# EasyEDA schematic L6205PD-Dual-Breakout-Board-B.00.02.json
TITLE: L6205PD-Breakout-Board; REV: B.00.02; Date: 2024-02-06; Sheet: 1/1; Drawn By: helmut-f; Company: Your Company
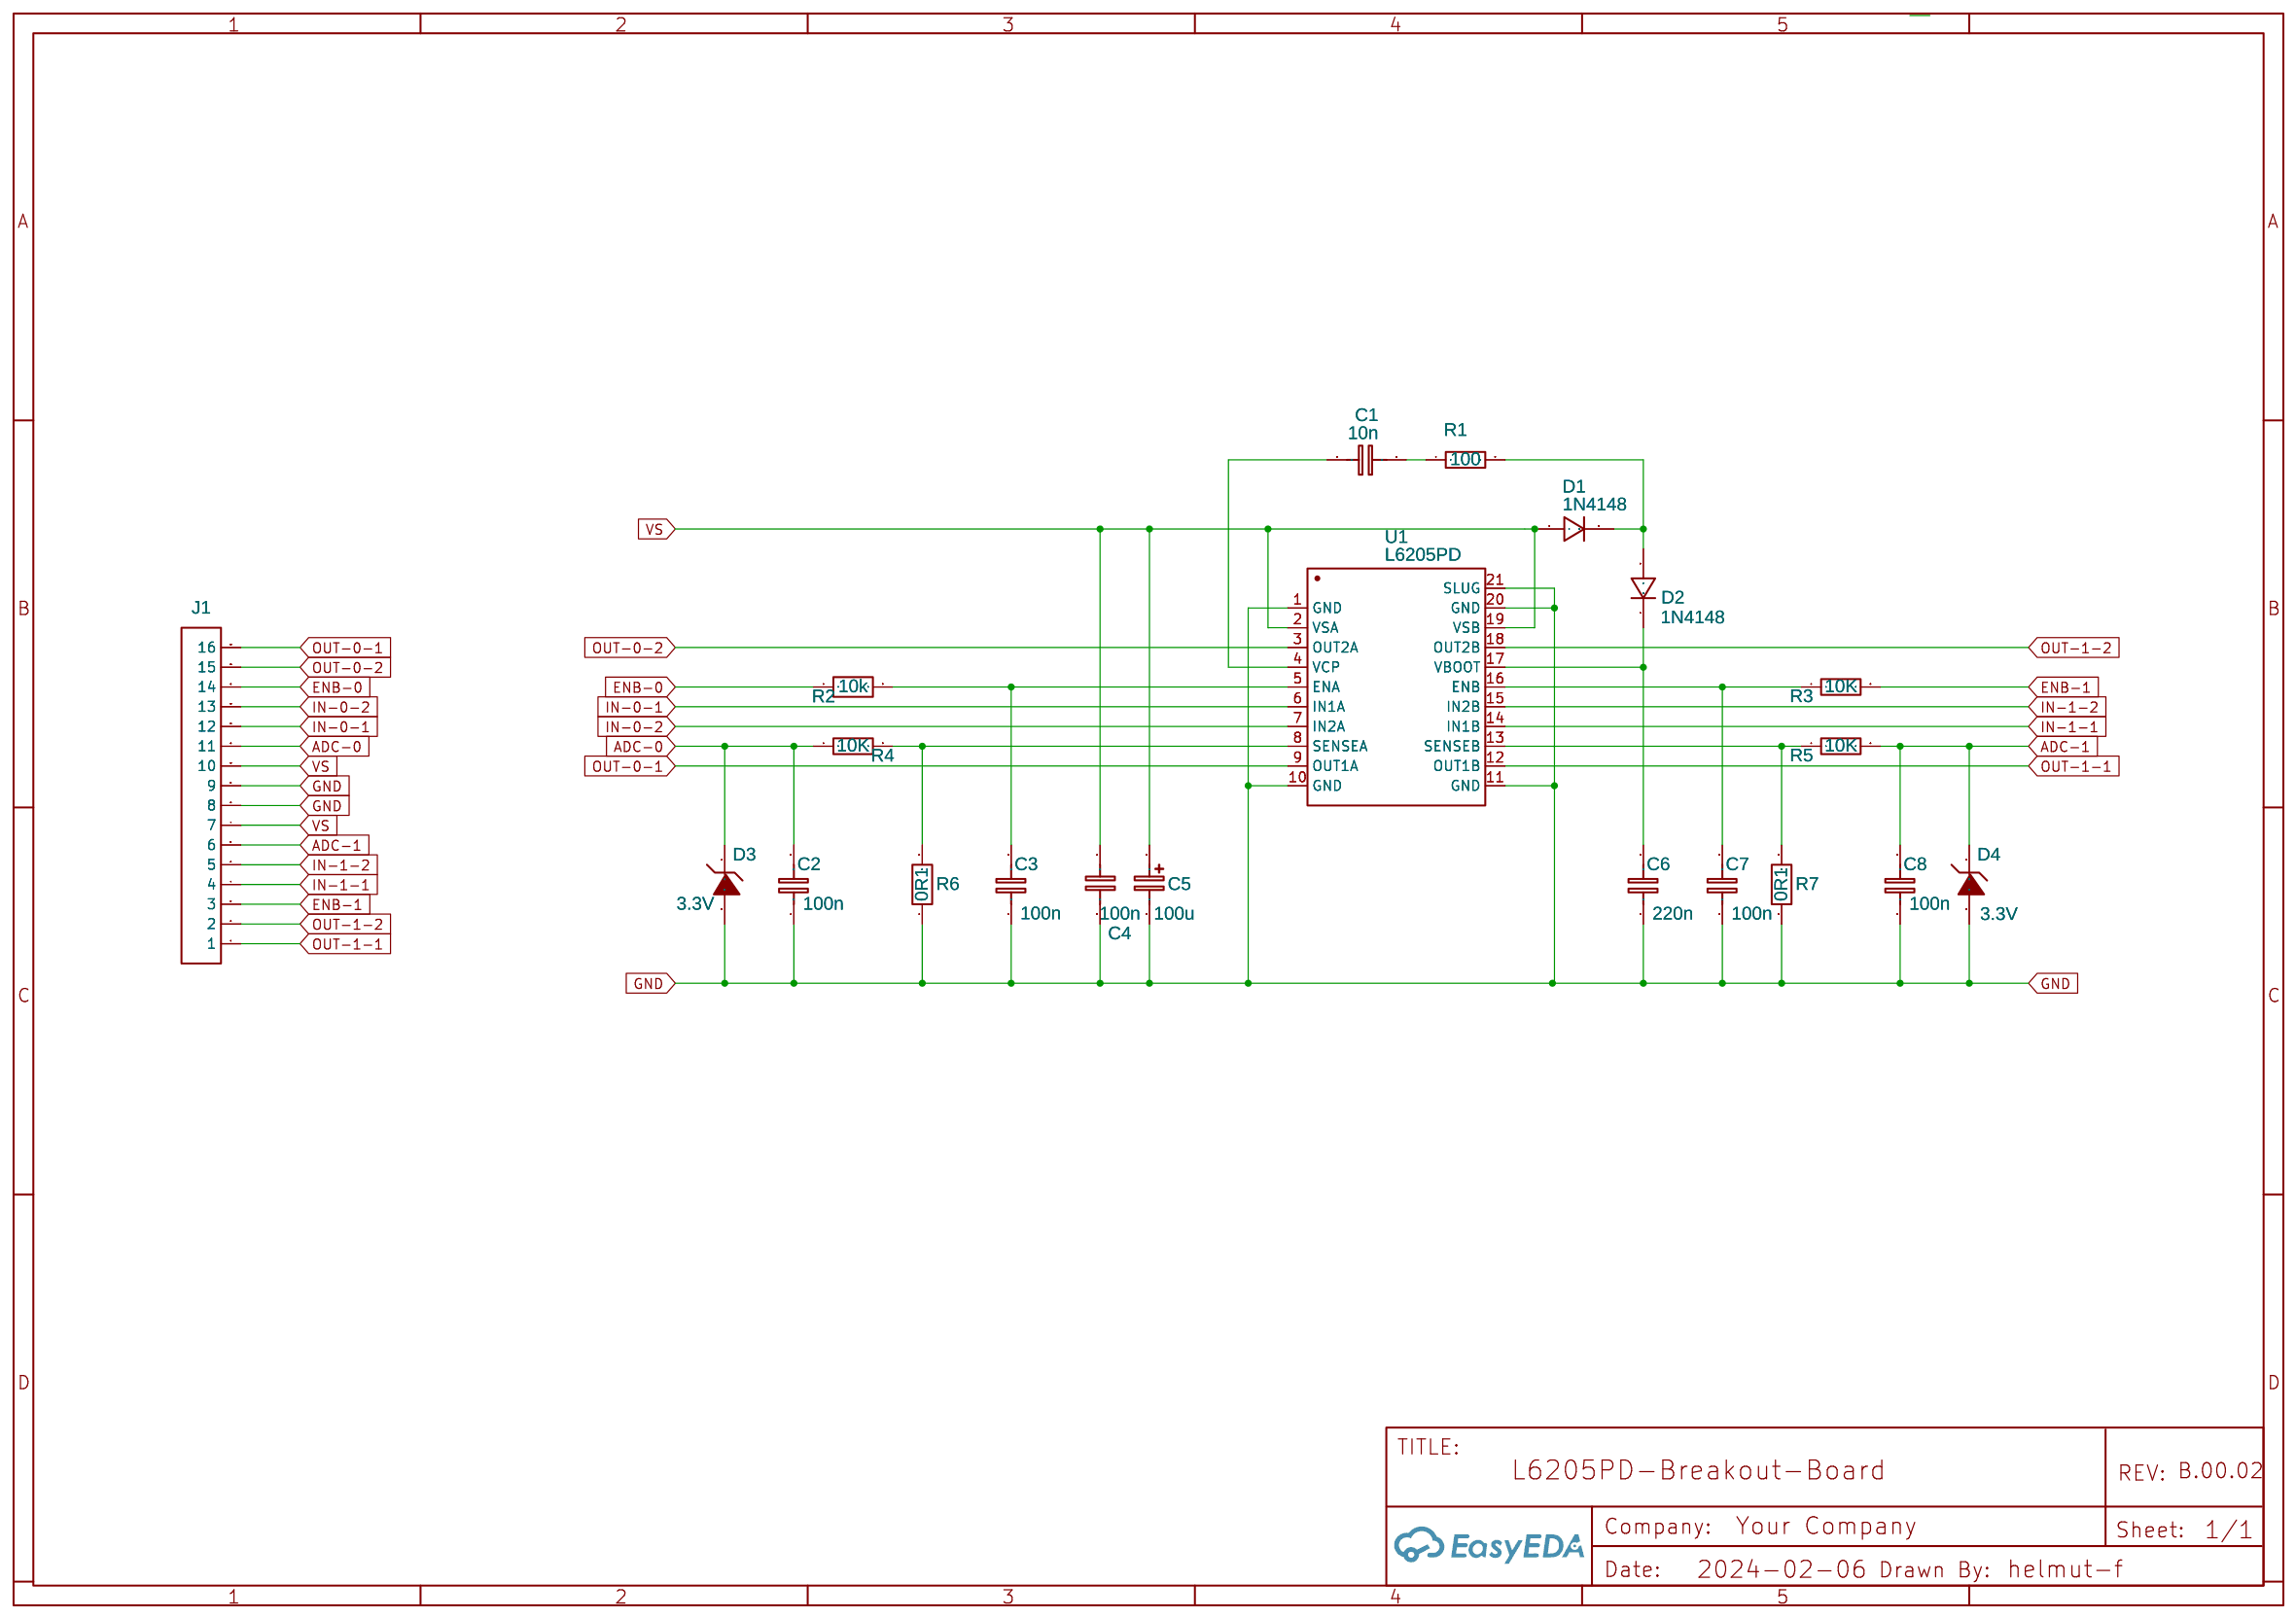
[diagram p0: schematic sheet]

## Parts
C1  10n  [C1206]
C2  100n  [C1206]
C3  100n  [C1206]
C4  100n  [C1206]
C5  100u  [CAP-D6.3×H7.7]
C6  220n  [C1206]
C7  100n  [C1206]
C8  100n  [C1206]
D1  1N4148  [SOD-80C_L3.3-W1.5-RD]
D2  1N4148  [SOD-80C_L3.3-W1.5-RD]
D3  3.3V  [SOD-80C_L3.3-W1.5-RD]
D4  3.3V  [SOD-80C_L3.3-W1.5-RD]
J1  HDR-M-2.54_1x16  [HDR-M-2.54_1X16]
R1  100  [R1206]
R2  10k  [R1206]
R3  10K  [R1206]
R4  10K  [R1206]
R5  10K  [R1206]
R6  0R1  [R_AXIAL-0.8]
R7  0R1  [R_AXIAL-0.8]
U1  L6205PD  [POWERSO20_L15.9-W11.0-P1.27-LS14.2-BL-EP]

## Library data of the parts
C1-C3 C6-C8 = C_0603_EU: Contributor: LCEDA_Lib
C4 = C_0603_EU: Contributor: LCEDA_Lib; Package Display: No
C5 = CE_SMD_D5.0×H5.5_EU: Contributor: LCEDA_Lib
D1 D2 = 1N4148: Supplier: LCSC; Manufacturer: SEMTECH; Supplier Part: C14516; Contributor: LCEDA_Lib
D3 D4 = Diode Zener: Supplier: LCSC; Manufacturer: SEMTECH; Supplier Part: C14516; JLCPCB Part Class: Extended Part; Contributor: Arrost
J1 = HDR-M-2.54_1x16: Supplier: LCSC; Contributor: LCEDA_Lib
R1 R3-R5 = RESISTOR-AXIAL-0.1
R2 R7 = R_AXIAL-0.3_EU: Contributor: LCEDA_Lib; Package Display: No
R6 = R_AXIAL-0.3_EU: Contributor: LCEDA_Lib
U1 = L6205PD: Supplier: LCSC; Manufacturer: ST(意法半导体); Manufacturer Part: L6205PD013TR; Supplier Part: C36543; JLCPCB Part Class: Extended Part

## Nets
GND: C2.1 C3.1 C4.2 C5.2 C6.1 C7.1 C8.1 D3.2(A) D4.2(A) J1.8 J1.9 R6.1 R7.1 U1.1(GND) U1.10(GND) U1.11(GND) U1.20(GND) U1.21(SLUG)
ADC-0: C2.2 D3.1(C) J1.11 R4.1
ADC-1: C8.2 D4.1(C) J1.6 R5.2
ENB-0: J1.14 R2.1
ENB-1: J1.3 R3.2
IN-0-1: J1.12 U1.6(IN1A)
IN-0-2: J1.13 U1.7(IN2A)
IN-1-1: J1.4 U1.14(IN1B)
IN-1-2: J1.5 U1.15(IN2B)
OUT-0-1: J1.16 U1.9(OUT1A)
OUT-0-2: J1.15 U1.3(OUT2A)
OUT-1-1: J1.1 U1.12(OUT1B)
OUT-1-2: J1.2 U1.18(OUT2B)
VS: C4.1 C5.1 D1.2(1) J1.7 J1.10 U1.2(VSA) U1.19(VSB)
Net-(C1-1): C1.1 U1.4(VCP)
Net-(C1-2): C1.2 R1.1
Net-(C3-2): C3.2 R2.2 U1.5(ENA)
Net-(C6-2): C6.2 D2.1(2) U1.17(VBOOT)
Net-(C7-2): C7.2 R3.1 U1.16(ENB)
Net-(D1-1): D1.1(2) D2.2(1) R1.2
Net-(R4-2): R4.2 R6.2 U1.8(SENSEA)
Net-(R5-1): R5.1 R7.2 U1.13(SENSEB)
